# Altium project CloudF4Block_MicroPython.PrjPcb
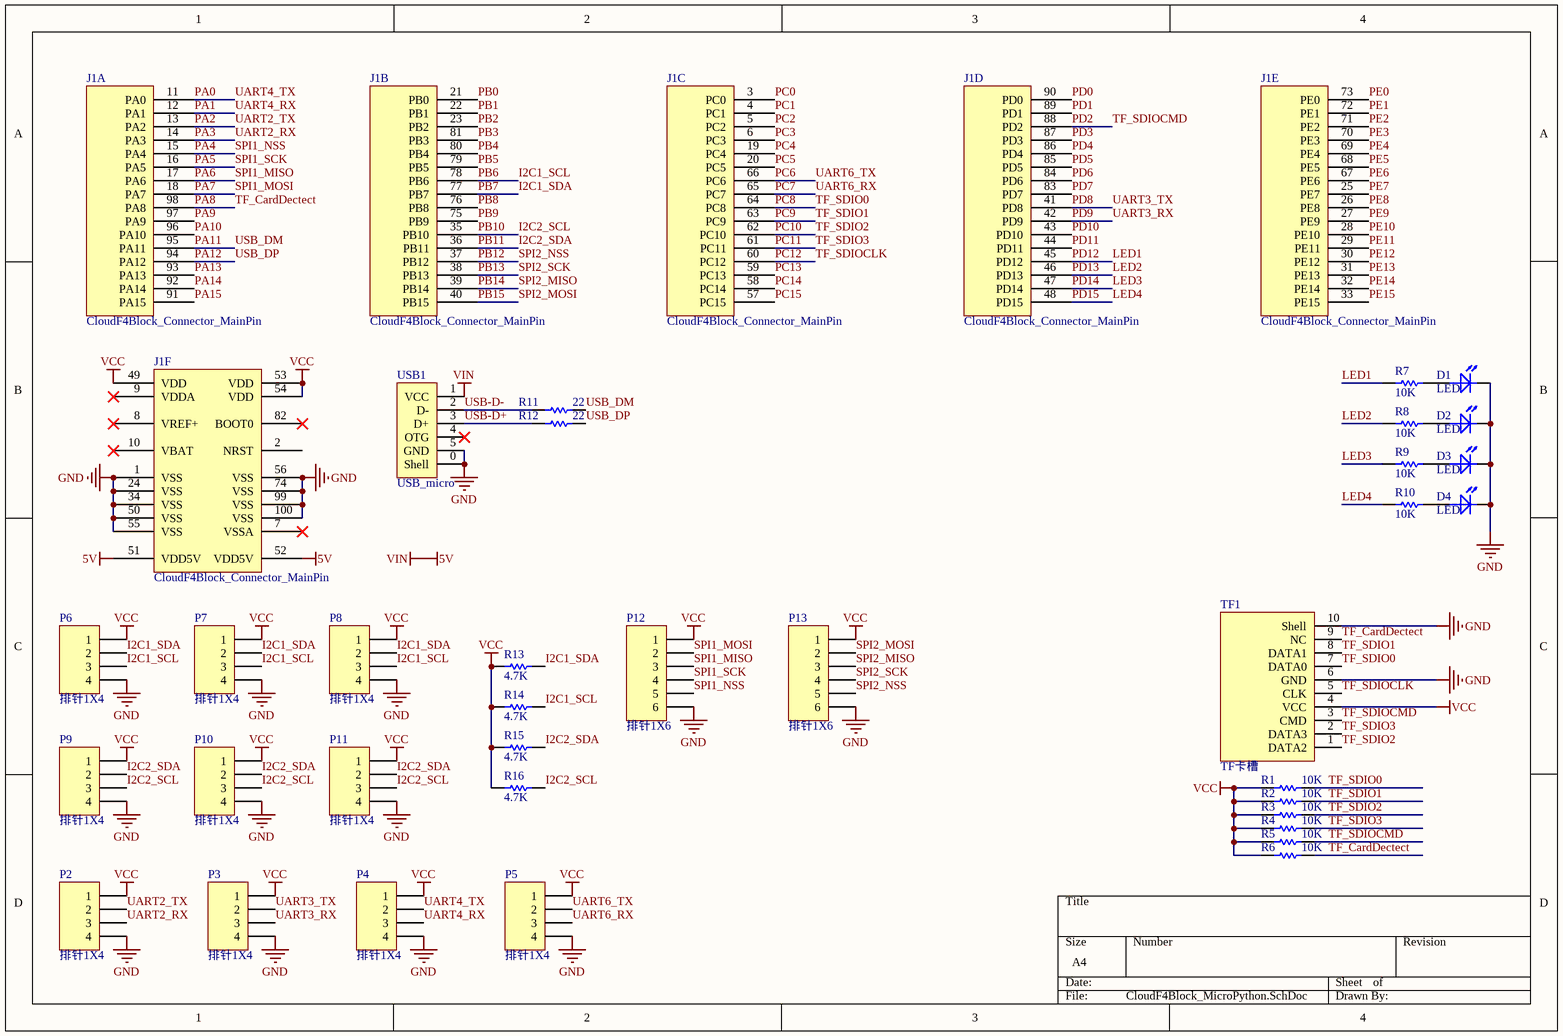
[diagram p0: CloudF4Block_MicroPython.SchDoc]
1 sheet, 35 parts. Net scope: global (net labels, ports and power ports of the same name join across sheets).
Board file: CloudF4Block_MicroPython.PcbDoc

## Sheet CloudF4Block_MicroPython.SchDoc
size A4

### Parts
D1  LED  [0603LED_RED]
D2  LED  [0603LED_GREEN]
D3  LED  [0603LED_ORANGE]
D4  LED  [0603LED_YELLOW]
J1  CloudF4Block_Connector_MainPin  [CloudF4BlockConnector]  (parts A,B,C,D,E,F of 6)
P2  排针1X4  [IDC1x4-2.54]
P3  排针1X4  [IDC1x4-2.54]
P4  排针1X4  [IDC1x4-2.54]
P5  排针1X4  [IDC1x4-2.54]
P6  排针1X4  [IDC1x4-2.54]
P7  排针1X4  [IDC1x4-2.54]
P8  排针1X4  [IDC1x4-2.54]
P9  排针1X4  [IDC1x4-2.54]
P10  排针1X4  [IDC1x4-2.54]
P11  排针1X4  [IDC1x4-2.54]
P12  排针1X6  [IDC1x6-2.54]
P13  排针1X6  [IDC1x6-2.54]
R1  value 10K  [R-0603]  (hidden comment: RES)
R2  value 10K  [R-0603]  (hidden comment: RES)
R3  value 10K  [R-0603]  (hidden comment: RES)
R4  value 10K  [R-0603]  (hidden comment: RES)
R5  value 10K  [R-0603]  (hidden comment: RES)
R6  value 10K  [R-0603]  (hidden comment: RES)
R7  value 10K  [R-0603]  (hidden comment: RES)
R8  value 10K  [R-0603]  (hidden comment: RES)
R9  value 10K  [R-0603]  (hidden comment: RES)
R10  value 10K  [R-0603]  (hidden comment: RES)
R11  value 22  [R-0603]  (hidden comment: RES)
R12  value 22  [R-0603]  (hidden comment: RES)
R13  value 4.7K  [R-0603]  (hidden comment: RES)
R14  value 4.7K  [R-0603]  (hidden comment: RES)
R15  value 4.7K  [R-0603]  (hidden comment: RES)
R16  value 4.7K  [R-0603]  (hidden comment: RES)
TF1  TF卡槽  [TF_Card]
USB1  USB_micro  [USB-MICRO]

### Nets
5V: J1.51(VDD5V) J1.52(VDD5V) USB1.1(VCC)  [also labelled VIN]
GND: D1.2(K) D2.2(K) D3.2(K) D4.2(K) J1.1(VSS) J1.24(VSS) J1.34(VSS) J1.50(VSS) J1.55(VSS) J1.56(VSS) J1.74(VSS) J1.99(VSS) J1.100(VSS) P2.4 P3.4 P4.4 P5.4 P6.4 P7.4 P8.4 P9.4 P10.4 P11.4 P12.6 P13.6 TF1.6(GND) TF1.10(Shell) USB1.0(Shell) USB1.5(GND)
VCC: J1.49(VDD) J1.53(VDD) J1.54(VDD) P2.1 P3.1 P4.1 P5.1 P6.1 P7.1 P8.1 P9.1 P10.1 P11.1 P12.1 P13.1 R1.1 R2.1 R3.1 R4.1 R5.1 R6.1 R13.1 R14.1 R15.1 R16.1 TF1.4(VCC)
I2C1_SCL: J1.78(PB6) P6.3 P7.3 P8.3 R14.2  [also labelled PB6]
I2C1_SDA: J1.77(PB7) P6.2 P7.2 P8.2 R13.2  [also labelled PB7]
I2C2_SCL: J1.35(PB10) P9.3 P10.3 P11.3 R16.2  [also labelled PB10]
I2C2_SDA: J1.36(PB11) P9.2 P10.2 P11.2 R15.2  [also labelled PB11]
LED1: J1.45(PD12) R7.2  [also labelled PD12]
LED2: J1.46(PD13) R8.2  [also labelled PD13]
LED3: J1.47(PD14) R9.2  [also labelled PD14]
LED4: J1.48(PD15) R10.2  [also labelled PD15]
PA0: J1.11(PA0) P4.2  [also labelled UART4_TX]
PA1: J1.12(PA1) P4.3  [also labelled UART4_RX]
PA2: J1.13(PA2) P2.2  [also labelled UART2_TX]
PA3: J1.14(PA3) P2.3  [also labelled UART2_RX]
PA4: J1.15(PA4) P12.5  [also labelled SPI1_NSS]
PA5: J1.16(PA5) P12.4  [also labelled SPI1_SCK]
PA6: J1.17(PA6) P12.3  [also labelled SPI1_MISO]
PA7: J1.18(PA7) P12.2  [also labelled SPI1_MOSI]
PA8: J1.98(PA8) R6.2 TF1.9(NC)  [also labelled TF_CardDectect]
PA9: J1.97(PA9)
PA10: J1.96(PA10)
PA11: J1.95(PA11) R11.1  [also labelled USB_DM]
PA12: J1.94(PA12) R12.1  [also labelled USB_DP]
PA13: J1.93(PA13)
PA14: J1.92(PA14)
PA15: J1.91(PA15)
PB0: J1.21(PB0)
PB1: J1.22(PB1)
PB2: J1.23(PB2)
PB3: J1.81(PB3)
PB4: J1.80(PB4)
PB5: J1.79(PB5)
PB8: J1.76(PB8)
PB9: J1.75(PB9)
PB12: J1.37(PB12) P13.5  [also labelled SPI2_NSS]
PB13: J1.38(PB13) P13.4  [also labelled SPI2_SCK]
PB14: J1.39(PB14) P13.3  [also labelled SPI2_MISO]
PB15: J1.40(PB15) P13.2  [also labelled SPI2_MOSI]
PC0: J1.3(PC0)
PC1: J1.4(PC1)
PC2: J1.5(PC2)
PC3: J1.6(PC3)
PC4: J1.19(PC4)
PC5: J1.20(PC5)
PC6: J1.66(PC6) P5.2  [also labelled UART6_TX]
PC7: J1.65(PC7) P5.3  [also labelled UART6_RX]
PC8: J1.64(PC8) R1.2 TF1.7(DATA0)  [also labelled TF_SDIO0]
PC9: J1.63(PC9) R2.2 TF1.8(DATA1)  [also labelled TF_SDIO1]
PC10: J1.62(PC10) R3.2 TF1.1(DATA2)  [also labelled TF_SDIO2]
PC11: J1.61(PC11) R4.2 TF1.2(DATA3)  [also labelled TF_SDIO3]
PC12: J1.60(PC12) TF1.5(CLK)  [also labelled TF_SDIOCLK]
PC13: J1.59(PC13)
PC14: J1.58(PC14)
PC15: J1.57(PC15)
PD0: J1.90(PD0)
PD1: J1.89(PD1)
PD2: J1.88(PD2) R5.2 TF1.3(CMD)  [also labelled TF_SDIOCMD]
PD3: J1.87(PD3)
PD4: J1.86(PD4)
PD5: J1.85(PD5)
PD6: J1.84(PD6)
PD7: J1.83(PD7)
PD8: J1.41(PD8) P3.2  [also labelled UART3_TX]
PD9: J1.42(PD9) P3.3  [also labelled UART3_RX]
PD10: J1.43(PD10)
PD11: J1.44(PD11)
PE0: J1.73(PE0)
PE1: J1.72(PE1)
PE2: J1.71(PE2)
PE3: J1.70(PE3)
PE4: J1.69(PE4)
PE5: J1.68(PE5)
PE6: J1.67(PE6)
PE7: J1.25(PE7)
PE8: J1.26(PE8)
PE9: J1.27(PE9)
PE10: J1.28(PE10)
PE11: J1.29(PE11)
PE12: J1.30(PE12)
PE13: J1.31(PE13)
PE14: J1.32(PE14)
PE15: J1.33(PE15)
USB-D+: R12.2 USB1.3(D+)
USB-D-: R11.2 USB1.2(D-)
NetD1_1: D1.1(A) R7.1
NetD2_1: D2.1(A) R8.1
NetD3_1: D3.1(A) R9.1
NetD4_1: D4.1(A) R10.1

Not connected (* = marked no-connect by the designer): J1 2(NRST) 7(VSSA)* 8(VREF+)* 9(VDDA)* 10(VBAT)* 82(BOOT0)*; USB1 4(OTG)*